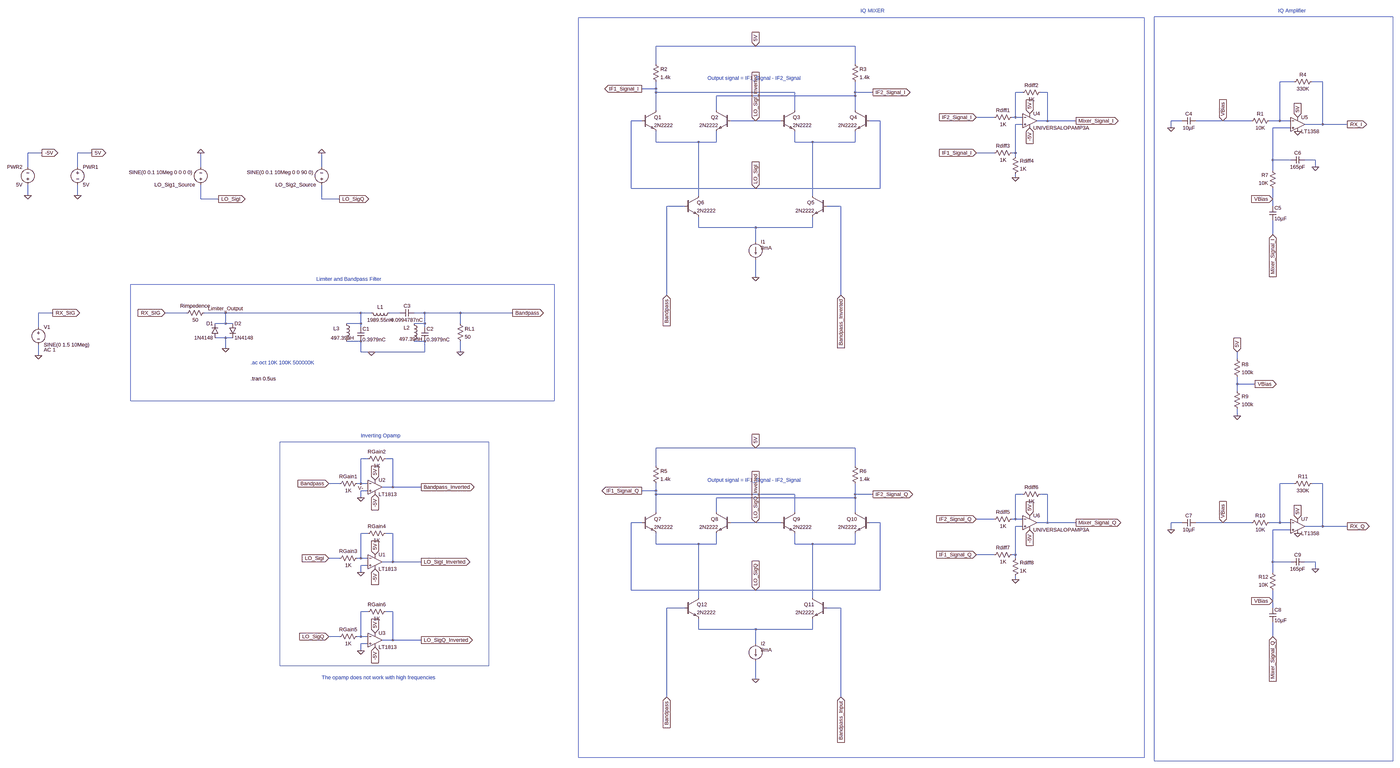
[diagram p0: schematic FULL_SCHEMATIC.asc, whole sheet]
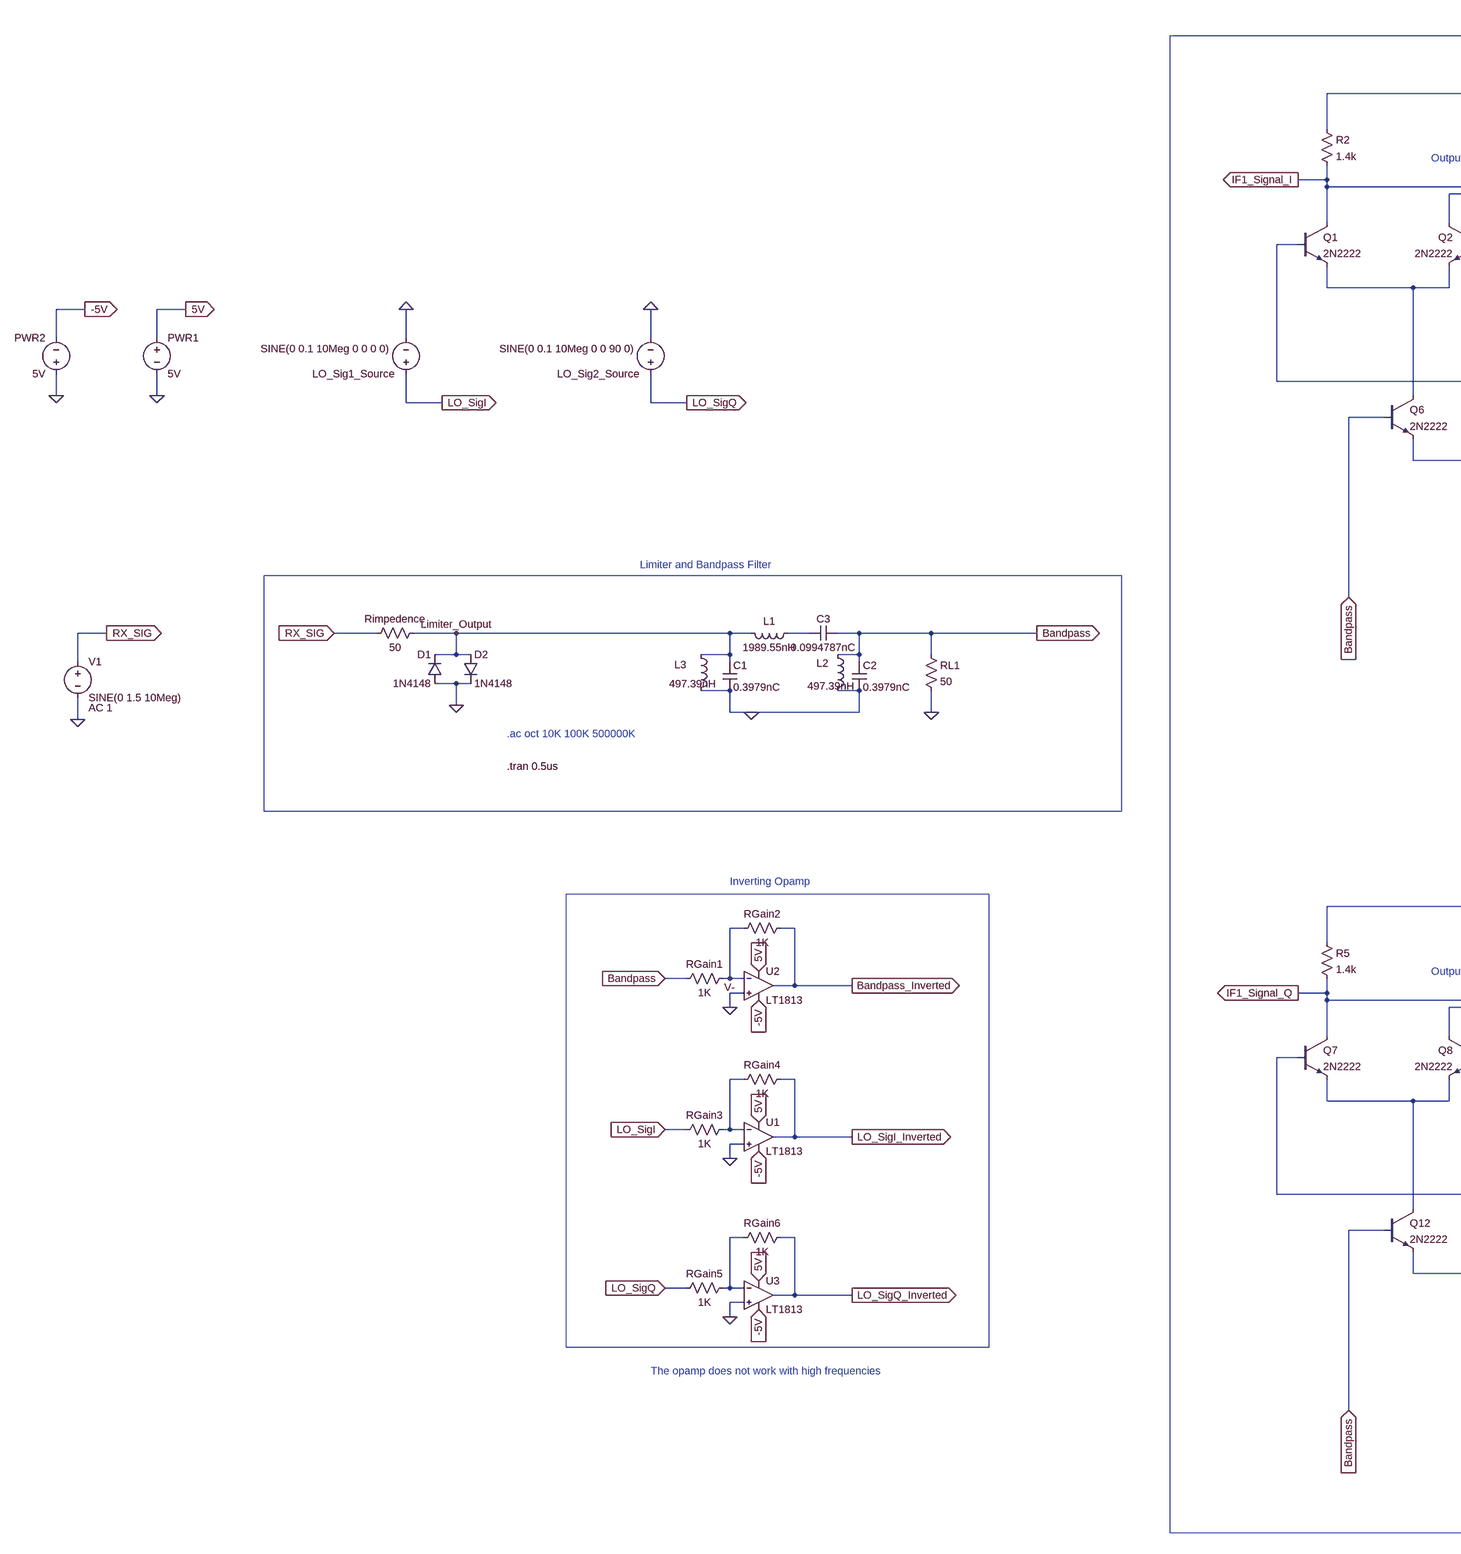
[diagram p1: schematic FULL_SCHEMATIC.asc, part, row 1 of 1, column 1 of 2]
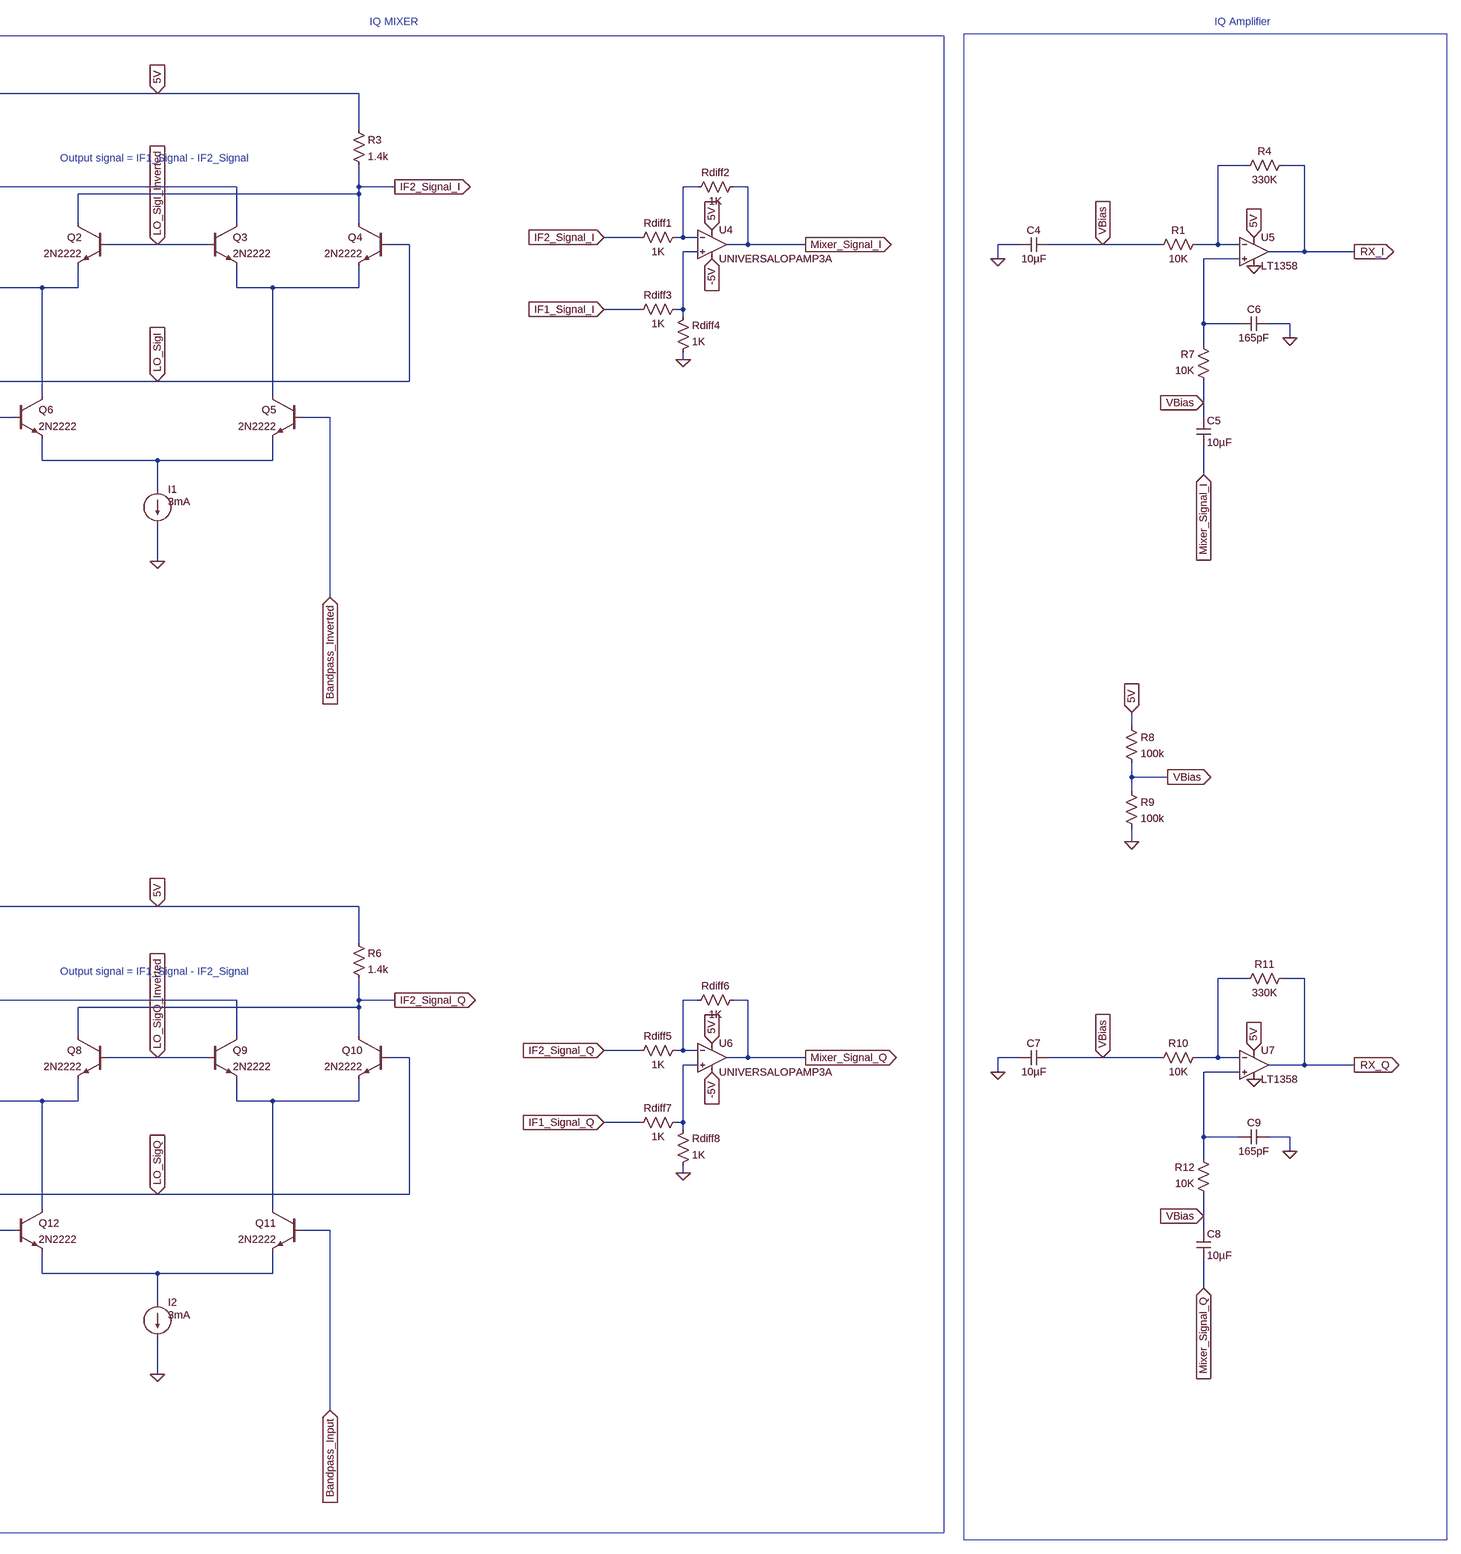
[diagram p2: schematic FULL_SCHEMATIC.asc, part, row 1 of 1, column 2 of 2]
FULL_SCHEMATIC.asc, the LTspice schematic file:
Version 4
SHEET 1 5976 2164
WIRE 2752 -1056 2304 -1056
WIRE 3200 -1056 2752 -1056
WIRE 2304 -976 2304 -1056
WIRE 3200 -976 3200 -1056
WIRE 5344 -896 5280 -896
WIRE 5472 -896 5424 -896
WIRE 2304 -864 2304 -896
WIRE 2304 -864 2240 -864
WIRE 2304 -848 2304 -864
WIRE 2928 -848 2304 -848
WIRE 3200 -848 3200 -896
WIRE 3280 -848 3200 -848
WIRE 4048 -848 4016 -848
WIRE 4160 -848 4128 -848
WIRE 3200 -832 3200 -848
WIRE 3200 -832 2576 -832
WIRE 2304 -768 2304 -848
WIRE 2576 -768 2576 -832
WIRE 2928 -768 2928 -848
WIRE 3200 -768 3200 -832
WIRE 3920 -736 3840 -736
WIRE 4016 -736 4016 -848
WIRE 4016 -736 4000 -736
WIRE 4048 -736 4016 -736
WIRE 2240 -720 2192 -720
WIRE 2752 -720 2640 -720
WIRE 2864 -720 2752 -720
WIRE 3312 -720 3264 -720
WIRE 4160 -720 4160 -848
WIRE 4160 -720 4112 -720
WIRE 4288 -720 4160 -720
WIRE 4832 -720 4784 -720
WIRE 5024 -720 4896 -720
WIRE 5152 -720 5024 -720
WIRE 5280 -720 5280 -896
WIRE 5280 -720 5232 -720
WIRE 5328 -720 5280 -720
WIRE 4048 -704 4016 -704
WIRE 5472 -704 5472 -896
WIRE 5472 -704 5392 -704
WIRE 5680 -704 5472 -704
WIRE 4784 -688 4784 -720
WIRE 5328 -688 5248 -688
WIRE 2304 -624 2304 -672
WIRE 2496 -624 2304 -624
WIRE 2576 -624 2576 -672
WIRE 2576 -624 2496 -624
WIRE 2928 -624 2928 -672
WIRE 3008 -624 2928 -624
WIRE 3200 -624 3200 -672
WIRE 3200 -624 3008 -624
WIRE -704 -576 -768 -576
WIRE -480 -576 -544 -576
WIRE 3920 -576 3840 -576
WIRE 4016 -576 4016 -704
WIRE 4016 -576 4000 -576
WIRE 4016 -560 4016 -576
WIRE 5248 -544 5248 -688
WIRE 5328 -544 5248 -544
WIRE 5440 -544 5392 -544
WIRE -768 -512 -768 -576
WIRE -544 -512 -544 -576
WIRE 48 -512 48 -576
WIRE 592 -512 592 -576
WIRE 5440 -512 5440 -544
WIRE 5248 -496 5248 -544
WIRE 4016 -464 4016 -480
WIRE 2192 -416 2192 -720
WIRE 2752 -416 2192 -416
WIRE 3312 -416 3312 -720
WIRE 3312 -416 2752 -416
WIRE -768 -384 -768 -432
WIRE -544 -384 -544 -432
WIRE 2496 -384 2496 -624
WIRE 3008 -384 3008 -624
WIRE 48 -368 48 -432
WIRE 128 -368 48 -368
WIRE 592 -368 592 -432
WIRE 672 -368 592 -368
WIRE 5248 -368 5248 -416
WIRE 2432 -336 2352 -336
WIRE 3136 -336 3072 -336
WIRE 5248 -336 5248 -368
WIRE 2496 -240 2496 -288
WIRE 2752 -240 2496 -240
WIRE 3008 -240 3008 -288
WIRE 3008 -240 2752 -240
WIRE 5248 -208 5248 -272
WIRE 2752 -176 2752 -240
WIRE 2752 -16 2752 -96
WIRE 2352 64 2352 -336
WIRE 3136 64 3136 -336
WIRE -656 144 -720 144
WIRE -16 144 -112 144
WIRE 160 144 64 144
WIRE 768 144 160 144
WIRE 816 144 768 144
WIRE 944 144 896 144
WIRE 1056 144 1008 144
WIRE 1216 144 1056 144
WIRE 1616 144 1216 144
WIRE 160 192 160 144
WIRE 160 192 112 192
WIRE 192 192 160 192
WIRE 768 192 768 144
WIRE 768 192 704 192
WIRE 1056 192 1056 144
WIRE 1056 192 1008 192
WIRE 1216 192 1216 144
WIRE -720 208 -720 144
WIRE 768 208 768 192
WIRE 1056 208 1056 192
WIRE 160 256 112 256
WIRE 192 256 160 256
WIRE 768 272 704 272
WIRE 1056 272 1008 272
WIRE 160 304 160 256
WIRE 768 320 768 272
WIRE 816 320 768 320
WIRE 1056 320 1056 272
WIRE 1056 320 816 320
WIRE 1216 320 1216 272
WIRE -720 336 -720 288
WIRE 5088 352 5088 320
WIRE 5088 464 5088 432
WIRE 5168 464 5088 464
WIRE 5088 496 5088 464
WIRE 5088 608 5088 576
WIRE 2752 752 2304 752
WIRE 3200 752 2752 752
WIRE 800 800 768 800
WIRE 912 800 880 800
WIRE 2304 832 2304 752
WIRE 3200 832 3200 752
WIRE 672 912 624 912
WIRE 768 912 768 800
WIRE 768 912 752 912
WIRE 800 912 768 912
WIRE 5344 912 5280 912
WIRE 5472 912 5424 912
WIRE 912 928 912 800
WIRE 912 928 864 928
WIRE 1040 928 912 928
WIRE 800 944 768 944
WIRE 2304 944 2304 912
WIRE 2304 944 2240 944
WIRE 2304 960 2304 944
WIRE 2928 960 2304 960
WIRE 3200 960 3200 912
WIRE 3280 960 3200 960
WIRE 4048 960 4016 960
WIRE 4160 960 4128 960
WIRE 768 976 768 944
WIRE 3200 976 3200 960
WIRE 3200 976 2576 976
WIRE 2304 1040 2304 960
WIRE 2576 1040 2576 976
WIRE 2928 1040 2928 960
WIRE 3200 1040 3200 976
WIRE 3920 1072 3840 1072
WIRE 4016 1072 4016 960
WIRE 4016 1072 4000 1072
WIRE 4048 1072 4016 1072
WIRE 2240 1088 2192 1088
WIRE 2752 1088 2640 1088
WIRE 2864 1088 2752 1088
WIRE 3312 1088 3264 1088
WIRE 4160 1088 4160 960
WIRE 4160 1088 4112 1088
WIRE 4288 1088 4160 1088
WIRE 4832 1088 4784 1088
WIRE 5024 1088 4896 1088
WIRE 5152 1088 5024 1088
WIRE 5280 1088 5280 912
WIRE 5280 1088 5232 1088
WIRE 5328 1088 5280 1088
WIRE 4048 1104 4016 1104
WIRE 5472 1104 5472 912
WIRE 5472 1104 5392 1104
WIRE 5680 1104 5472 1104
WIRE 4784 1120 4784 1088
WIRE 5328 1120 5248 1120
WIRE 800 1136 768 1136
WIRE 912 1136 880 1136
WIRE 2304 1184 2304 1136
WIRE 2496 1184 2304 1184
WIRE 2576 1184 2576 1136
WIRE 2576 1184 2496 1184
WIRE 2928 1184 2928 1136
WIRE 3008 1184 2928 1184
WIRE 3200 1184 3200 1136
WIRE 3200 1184 3008 1184
WIRE 3920 1232 3840 1232
WIRE 4016 1232 4016 1104
WIRE 4016 1232 4000 1232
WIRE 672 1248 624 1248
WIRE 768 1248 768 1136
WIRE 768 1248 752 1248
WIRE 800 1248 768 1248
WIRE 4016 1248 4016 1232
WIRE 912 1264 912 1136
WIRE 912 1264 864 1264
WIRE 1040 1264 912 1264
WIRE 5248 1264 5248 1120
WIRE 5328 1264 5248 1264
WIRE 5440 1264 5392 1264
WIRE 800 1280 768 1280
WIRE 5440 1296 5440 1264
WIRE 768 1312 768 1280
WIRE 5248 1312 5248 1264
WIRE 4016 1344 4016 1328
WIRE 2192 1392 2192 1088
WIRE 2752 1392 2192 1392
WIRE 3312 1392 3312 1088
WIRE 3312 1392 2752 1392
WIRE 2496 1424 2496 1184
WIRE 3008 1424 3008 1184
WIRE 5248 1440 5248 1392
WIRE 2432 1472 2352 1472
WIRE 3136 1472 3072 1472
WIRE 5248 1472 5248 1440
WIRE 800 1488 768 1488
WIRE 912 1488 880 1488
WIRE 2496 1568 2496 1520
WIRE 2752 1568 2496 1568
WIRE 3008 1568 3008 1520
WIRE 3008 1568 2752 1568
WIRE 672 1600 624 1600
WIRE 768 1600 768 1488
WIRE 768 1600 752 1600
WIRE 800 1600 768 1600
WIRE 5248 1600 5248 1536
WIRE 912 1616 912 1488
WIRE 912 1616 864 1616
WIRE 1040 1616 912 1616
WIRE 800 1632 768 1632
WIRE 2752 1632 2752 1568
WIRE 768 1664 768 1632
WIRE 2752 1792 2752 1712
WIRE 2352 1872 2352 1472
WIRE 3136 1872 3136 1472
FLAG 160 144 Limiter_Output
FLAG -112 144 RX_SIG
IOPIN -112 144 In
FLAG 816 320 0
FLAG -720 336 0
FLAG -656 144 RX_SIG
IOPIN -656 144 Out
FLAG 160 304 0
FLAG 2752 -16 0
FLAG 2240 -864 IF1_Signal_I
IOPIN 2240 -864 Out
FLAG 3280 -848 IF2_Signal_I
IOPIN 3280 -848 Out
FLAG 2752 -1056 5V
IOPIN 2752 -1056 In
FLAG -544 -384 0
FLAG -480 -576 5V
IOPIN -480 -576 Out
FLAG -768 -384 0
FLAG -704 -576 -5V
IOPIN -704 -576 Out
FLAG 1216 320 0
FLAG 832 1232 5V
IOPIN 832 1232 In
FLAG 832 1296 -5V
IOPIN 832 1296 In
FLAG 768 1312 0
FLAG 832 1584 5V
IOPIN 832 1584 In
FLAG 832 1648 -5V
IOPIN 832 1648 In
FLAG 768 1664 0
FLAG 832 896 5V
IOPIN 832 896 In
FLAG 832 960 -5V
IOPIN 832 960 In
FLAG 768 976 0
FLAG 1616 144 Bandpass
IOPIN 1616 144 Out
FLAG 1040 928 Bandpass_Inverted
IOPIN 1040 928 Out
FLAG 768 912 V-
FLAG 624 912 Bandpass
IOPIN 624 912 In
FLAG 48 -576 0
FLAG 128 -368 LO_SigI
IOPIN 128 -368 Out
FLAG 592 -576 0
FLAG 672 -368 LO_SigQ
IOPIN 672 -368 Out
FLAG 624 1248 LO_SigI
IOPIN 624 1248 In
FLAG 624 1600 LO_SigQ
IOPIN 624 1600 In
FLAG 1040 1264 LO_SigI_Inverted
IOPIN 1040 1264 Out
FLAG 1040 1616 LO_SigQ_Inverted
IOPIN 1040 1616 Out
FLAG 2352 64 Bandpass
IOPIN 2352 64 In
FLAG 3136 64 Bandpass_Inverted
IOPIN 3136 64 In
FLAG 2752 -720 LO_SigI_Inverted
IOPIN 2752 -720 In
FLAG 2752 -416 LO_SigI
IOPIN 2752 -416 In
FLAG 4080 -752 5V
IOPIN 4080 -752 In
FLAG 4080 -688 -5V
IOPIN 4080 -688 In
FLAG 4016 -464 0
FLAG 4288 -720 Mixer_Signal_I
IOPIN 4288 -720 Out
FLAG 3840 -576 IF1_Signal_I
IOPIN 3840 -576 In
FLAG 3840 -736 IF2_Signal_I
IOPIN 3840 -736 In
FLAG 5360 -736 5V
IOPIN 5360 -736 In
FLAG 5360 -672 0
FLAG 5680 -704 RX_I
IOPIN 5680 -704 Out
FLAG 4784 -688 0
FLAG 5088 608 0
FLAG 5088 320 5V
IOPIN 5088 320 In
FLAG 5440 -512 0
FLAG 5168 464 VBias
IOPIN 5168 464 Out
FLAG 5024 -720 VBias
IOPIN 5024 -720 In
FLAG 5248 -368 VBias
IOPIN 5248 -368 In
FLAG 5248 -208 Mixer_Signal_I
IOPIN 5248 -208 In
FLAG 2752 1792 0
FLAG 2240 944 IF1_Signal_Q
IOPIN 2240 944 Out
FLAG 3280 960 IF2_Signal_Q
IOPIN 3280 960 Out
FLAG 2752 752 5V
IOPIN 2752 752 In
FLAG 2352 1872 Bandpass
IOPIN 2352 1872 In
FLAG 3136 1872 Bandpass_Input
IOPIN 3136 1872 In
FLAG 2752 1088 LO_SigQ_Inverted
IOPIN 2752 1088 In
FLAG 2752 1392 LO_SigQ
IOPIN 2752 1392 In
FLAG 4080 1056 5V
IOPIN 4080 1056 In
FLAG 4080 1120 -5V
IOPIN 4080 1120 In
FLAG 4016 1344 0
FLAG 4288 1088 Mixer_Signal_Q
IOPIN 4288 1088 Out
FLAG 3840 1232 IF1_Signal_Q
IOPIN 3840 1232 In
FLAG 3840 1072 IF2_Signal_Q
IOPIN 3840 1072 In
FLAG 5360 1072 5V
IOPIN 5360 1072 In
FLAG 5360 1136 0
FLAG 5680 1104 RX_Q
IOPIN 5680 1104 Out
FLAG 4784 1120 0
FLAG 5440 1296 0
FLAG 5024 1088 VBias
IOPIN 5024 1088 In
FLAG 5248 1440 VBias
IOPIN 5248 1440 In
FLAG 5248 1600 Mixer_Signal_Q
IOPIN 5248 1600 In
SYMBOL Res 80 128 R90
WINDOW 0 0 56 VBottom 2
WINDOW 3 32 56 VTop 2
SYMATTR InstName Rimpedence
SYMATTR Value 50
SYMBOL diode 128 256 R180
WINDOW 0 24 64 Left 2
WINDOW 3 24 0 Left 2
SYMATTR InstName D1
SYMATTR Value 1N4148
SYMBOL diode 176 192 R0
SYMATTR InstName D2
SYMATTR Value 1N4148
SYMBOL Cap 752 208 R0
SYMATTR InstName C1
SYMATTR Value 0.3979nC
SYMBOL Cap 1040 208 R0
SYMATTR InstName C2
SYMATTR Value 0.3979nC
SYMBOL Ind 912 128 R90
WINDOW 0 5 56 VBottom 2
WINDOW 3 32 56 VTop 2
SYMATTR InstName L1
SYMATTR Value 1989.55nH
SYMBOL Res 1200 176 R0
SYMATTR InstName RL1
SYMATTR Value 50
SYMBOL ind 992 176 R0
WINDOW 0 -31 35 Left 2
WINDOW 3 -51 86 Left 2
SYMATTR InstName L2
SYMATTR Value 497.39nH
SYMBOL Ind 688 176 R0
WINDOW 0 -43 38 Left 2
WINDOW 3 -55 81 Left 2
SYMATTR InstName L3
SYMATTR Value 497.39nH
SYMBOL Cap 1008 128 R90
WINDOW 0 0 32 VBottom 2
WINDOW 3 32 32 VTop 2
SYMATTR InstName C3
SYMATTR Value 0.0994787nC
SYMBOL Voltage -720 192 R0
WINDOW 123 24 118 Left 2
SYMATTR Value2 AC 1
SYMATTR InstName V1
SYMATTR Value SINE(0 1.5 10Meg)
SYMBOL npn 2240 -768 R0
SYMATTR InstName Q1
SYMATTR Value 2N2222
SYMBOL npn 2640 -768 M0
SYMATTR InstName Q2
SYMATTR Value 2N2222
SYMBOL npn 2864 -768 R0
SYMATTR InstName Q3
SYMATTR Value 2N2222
SYMBOL npn 3264 -768 M0
SYMATTR InstName Q4
SYMATTR Value 2N2222
SYMBOL npn 3072 -384 M0
SYMATTR InstName Q5
SYMATTR Value 2N2222
SYMBOL npn 2432 -384 R0
SYMATTR InstName Q6
SYMATTR Value 2N2222
SYMBOL res 2288 -992 R0
SYMATTR InstName R2
SYMATTR Value 1.4k
SYMBOL res 3184 -992 R0
SYMATTR InstName R3
SYMATTR Value 1.4k
SYMBOL voltage 48 -416 R180
WINDOW 3 35 72 Left 2
WINDOW 123 0 0 Left 0
WINDOW 39 0 0 Left 0
SYMATTR Value SINE(0 0.1 10Meg 0 0 0 0)
SYMATTR InstName LO_Sig1_Source
SYMBOL current 2752 -176 R0
WINDOW 123 0 0 Left 0
WINDOW 39 0 0 Left 0
WINDOW 3 24 28 Left 2
SYMATTR Value 3mA
SYMATTR InstName I1
SYMBOL Voltage -544 -528 R0
SYMATTR InstName PWR1
SYMATTR Value 5V
SYMBOL Voltage -768 -416 R180
WINDOW 0 24 96 Left 2
WINDOW 3 24 16 Left 2
SYMATTR InstName PWR2
SYMATTR Value 5V
SYMBOL Res 768 1232 R90
WINDOW 0 0 56 VBottom 2
WINDOW 3 32 56 VTop 2
SYMATTR InstName RGain3
SYMATTR Value 1K
SYMBOL Res 896 1120 R90
WINDOW 0 0 56 VBottom 2
WINDOW 3 32 56 VTop 2
SYMATTR InstName RGain4
SYMATTR Value 1K
SYMBOL Res 768 1584 R90
WINDOW 0 0 56 VBottom 2
WINDOW 3 32 56 VTop 2
SYMATTR InstName RGain5
SYMATTR Value 1K
SYMBOL Res 896 1472 R90
WINDOW 0 0 56 VBottom 2
WINDOW 3 32 56 VTop 2
SYMATTR InstName RGain6
SYMATTR Value 1K
SYMBOL Res 768 896 R90
WINDOW 0 0 56 VBottom 2
WINDOW 3 32 56 VTop 2
SYMATTR InstName RGain1
SYMATTR Value 1K
SYMBOL Res 896 784 R90
WINDOW 0 0 56 VBottom 2
WINDOW 3 32 56 VTop 2
SYMATTR InstName RGain2
SYMATTR Value 1K
SYMBOL voltage 592 -416 R180
WINDOW 3 35 72 Left 2
WINDOW 123 0 0 Left 0
WINDOW 39 0 0 Left 0
SYMATTR Value SINE(0 0.1 10Meg 0 0 90 0)
SYMATTR InstName LO_Sig2_Source
SYMBOL Res 4016 -752 R90
WINDOW 0 0 56 VBottom 2
WINDOW 3 32 56 VTop 2
SYMATTR InstName Rdiff1
SYMATTR Value 1K
SYMBOL Res 4144 -864 R90
WINDOW 0 0 56 VBottom 2
WINDOW 3 32 56 VTop 2
SYMATTR InstName Rdiff2
SYMATTR Value 1K
SYMBOL OpAmps/UniversalOpAmp3a 4080 -720 R0
SYMATTR InstName U4
SYMBOL Res 4016 -592 R90
WINDOW 0 0 56 VBottom 2
WINDOW 3 32 56 VTop 2
SYMATTR InstName Rdiff3
SYMATTR Value 1K
SYMBOL Res 4000 -464 M180
WINDOW 0 36 76 Left 2
WINDOW 3 36 40 Left 2
SYMATTR InstName Rdiff4
SYMATTR Value 1K
SYMBOL Res 5248 -736 R90
WINDOW 0 0 56 VBottom 2
WINDOW 3 32 56 VTop 2
SYMATTR InstName R1
SYMATTR Value 10K
SYMBOL OpAmps/LT1358 5360 -768 R0
SYMATTR InstName U5
SYMBOL Res 5440 -912 R90
WINDOW 0 0 56 VBottom 2
WINDOW 3 32 56 VTop 2
SYMATTR InstName R4
SYMATTR Value 330K
SYMBOL Cap 4896 -736 R90
WINDOW 0 0 32 VBottom 2
WINDOW 3 32 32 VTop 2
SYMATTR InstName C4
SYMATTR Value 10µF
SYMBOL Res 5264 -400 R180
WINDOW 0 36 76 Left 2
WINDOW 3 36 40 Left 2
SYMATTR InstName R7
SYMATTR Value 10K
SYMBOL Cap 5232 -336 R0
SYMATTR InstName C5
SYMATTR Value 10µF
SYMBOL Res 5072 336 R0
SYMATTR InstName R8
SYMATTR Value 100k
SYMBOL Res 5072 480 R0
SYMATTR InstName R9
SYMATTR Value 100k
SYMBOL Cap 5392 -560 R90
WINDOW 0 0 32 VBottom 2
WINDOW 3 32 32 VTop 2
SYMATTR InstName C6
SYMATTR Value 165pF
SYMBOL npn 2240 1040 R0
SYMATTR InstName Q7
SYMATTR Value 2N2222
SYMBOL npn 2640 1040 M0
SYMATTR InstName Q8
SYMATTR Value 2N2222
SYMBOL npn 2864 1040 R0
SYMATTR InstName Q9
SYMATTR Value 2N2222
SYMBOL npn 3264 1040 M0
SYMATTR InstName Q10
SYMATTR Value 2N2222
SYMBOL npn 3072 1424 M0
SYMATTR InstName Q11
SYMATTR Value 2N2222
SYMBOL npn 2432 1424 R0
SYMATTR InstName Q12
SYMATTR Value 2N2222
SYMBOL res 2288 816 R0
SYMATTR InstName R5
SYMATTR Value 1.4k
SYMBOL res 3184 816 R0
SYMATTR InstName R6
SYMATTR Value 1.4k
SYMBOL current 2752 1632 R0
WINDOW 123 0 0 Left 0
WINDOW 39 0 0 Left 0
WINDOW 3 24 28 Left 2
SYMATTR Value 3mA
SYMATTR InstName I2
SYMBOL Res 4016 1056 R90
WINDOW 0 0 56 VBottom 2
WINDOW 3 32 56 VTop 2
SYMATTR InstName Rdiff5
SYMATTR Value 1K
SYMBOL Res 4144 944 R90
WINDOW 0 0 56 VBottom 2
WINDOW 3 32 56 VTop 2
SYMATTR InstName Rdiff6
SYMATTR Value 1K
SYMBOL OpAmps/UniversalOpAmp3a 4080 1088 R0
SYMATTR InstName U6
SYMBOL Res 4016 1216 R90
WINDOW 0 0 56 VBottom 2
WINDOW 3 32 56 VTop 2
SYMATTR InstName Rdiff7
SYMATTR Value 1K
SYMBOL Res 4000 1344 M180
WINDOW 0 36 76 Left 2
WINDOW 3 36 40 Left 2
SYMATTR InstName Rdiff8
SYMATTR Value 1K
SYMBOL Res 5248 1072 R90
WINDOW 0 0 56 VBottom 2
WINDOW 3 32 56 VTop 2
SYMATTR InstName R10
SYMATTR Value 10K
SYMBOL OpAmps/LT1358 5360 1040 R0
SYMATTR InstName U7
SYMBOL Res 5440 896 R90
WINDOW 0 0 56 VBottom 2
WINDOW 3 32 56 VTop 2
SYMATTR InstName R11
SYMATTR Value 330K
SYMBOL Cap 4896 1072 R90
WINDOW 0 0 32 VBottom 2
WINDOW 3 32 32 VTop 2
SYMATTR InstName C7
SYMATTR Value 10µF
SYMBOL Res 5264 1408 R180
WINDOW 0 36 76 Left 2
WINDOW 3 36 40 Left 2
SYMATTR InstName R12
SYMATTR Value 10K
SYMBOL Cap 5232 1472 R0
SYMATTR InstName C8
SYMATTR Value 10µF
SYMBOL Cap 5392 1248 R90
WINDOW 0 0 32 VBottom 2
WINDOW 3 32 32 VTop 2
SYMATTR InstName C9
SYMATTR Value 165pF
SYMBOL OpAmps/LT1813 832 864 R0
SYMATTR InstName U2
SYMBOL OpAmps/LT1813 832 1200 R0
SYMATTR InstName U1
SYMBOL OpAmps/LT1813 832 1552 R0
SYMATTR InstName U3
TEXT 272 368 Left 2 ;.ac oct 10K 100K 500000K
TEXT 272 440 Left 2 !.tran 0.5us
TEXT 2536 -912 Left 2 ;Output signal = IF1_Signal - IF2_Signal
TEXT 592 1784 Left 2 ;The opamp does not work with high frequencies
TEXT 2536 896 Left 2 ;Output signal = IF1_Signal - IF2_Signal
TEXT 3224 -1216 Left 2 ;IQ MIXER
TEXT 5272 -1216 Left 2 ;IQ Amplifier
TEXT 768 696 Left 2 ;Inverting Opamp
TEXT 568 -8 Left 2 ;Limiter and Bandpass Filter
RECTANGLE Normal 404 1732 1344 724
RECTANGLE Normal 1920 2144 4664 -1184
RECTANGLE Normal 4708 -1188 5972 2160
RECTANGLE Normal -268 16 1804 540

The netlist it stands for:
* FULL_SCHEMATIC.asc
Rimpedence Limiter_Output RX_SIG 50
D1 0 Limiter_Output 1N4148
D2 Limiter_Output 0 1N4148
C1 Limiter_Output 0 0.3979nC
C2 Bandpass 0 0.3979nC
L1 N008 Limiter_Output 1989.55nH
RL1 Bandpass 0 50
L2 Bandpass 0 497.39nH
L3 Limiter_Output 0 497.39nH
C3 Bandpass N008 0.0994787nC
V1 RX_SIG 0 SINE(0 1.5 10Meg) AC 1
Q1 IF1_Signal_I LO_SigI N005 0 2N2222
Q2 IF2_Signal_I LO_SigI_Inverted N005 0 2N2222
Q3 IF1_Signal_I LO_SigI_Inverted N006 0 2N2222
Q4 IF2_Signal_I LO_SigI N006 0 2N2222
Q5 N006 Bandpass_Inverted N007 0 2N2222
Q6 N005 Bandpass N007 0 2N2222
R2 5V IF1_Signal_I 1.4k
R3 5V IF2_Signal_I 1.4k
V§LO_Sig1_Source LO_SigI 0 SINE(0 0.1 10Meg 0 0 0 0)
I1 N007 0 3mA
V§PWR1 5V 0 5V
V§PWR2 0 -5V 5V
RGain3 N013 LO_SigI 1K
RGain4 LO_SigI_Inverted N013 1K
RGain5 N016 LO_SigQ 1K
RGain6 LO_SigQ_Inverted N016 1K
RGain1 V- Bandpass 1K
RGain2 Bandpass_Inverted V- 1K
V§LO_Sig2_Source LO_SigQ 0 SINE(0 0.1 10Meg 0 0 90 0)
Rdiff1 N002 IF2_Signal_I 1K
Rdiff2 Mixer_Signal_I N002 1K
XU4 N003 N002 5V -5V Mixer_Signal_I level3a Avol=1Meg GBW=10Meg Slew=10Meg Ilimit=25m Rail=0 Vos=0 Phimargin=45 En=0 Enk=0 In=0 Ink=0 Rin=500Meg  ; UNIVERSALOPAMP3A, pins In+ In- V+ V- OUT
Rdiff3 N003 IF1_Signal_I 1K
Rdiff4 0 N003 1K
R1 N001 VBias 10K
XU5 N004 N001 5V 0 RX_I LT1357  ; LT1358, pins In+ In- V+ V- OUT
R4 RX_I N001 330K
C4 VBias 0 10µF
R7 VBias N004 10K
C5 VBias Mixer_Signal_I 10µF
R8 5V VBias 100k
R9 VBias 0 100k
C6 0 N004 165pF
Q7 IF1_Signal_Q LO_SigQ N014 0 2N2222
Q8 IF2_Signal_Q LO_SigQ_Inverted N014 0 2N2222
Q9 IF1_Signal_Q LO_SigQ_Inverted N015 0 2N2222
Q10 IF2_Signal_Q LO_SigQ N015 0 2N2222
Q11 N015 Bandpass_Input N017 0 2N2222
Q12 N014 Bandpass N017 0 2N2222
R5 5V IF1_Signal_Q 1.4k
R6 5V IF2_Signal_Q 1.4k
I2 N017 0 3mA
Rdiff5 N010 IF2_Signal_Q 1K
Rdiff6 Mixer_Signal_Q N010 1K
XU6 N011 N010 5V -5V Mixer_Signal_Q level3a Avol=1Meg GBW=10Meg Slew=10Meg Ilimit=25m Rail=0 Vos=0 Phimargin=45 En=0 Enk=0 In=0 Ink=0 Rin=500Meg  ; UNIVERSALOPAMP3A, pins In+ In- V+ V- OUT
Rdiff7 N011 IF1_Signal_Q 1K
Rdiff8 0 N011 1K
R10 N009 VBias 10K
XU7 N012 N009 5V 0 RX_Q LT1357  ; LT1358, pins In+ In- V+ V- OUT
R11 RX_Q N009 330K
C7 VBias 0 10µF
R12 VBias N012 10K
C8 VBias Mixer_Signal_Q 10µF
C9 0 N012 165pF
XU2 0 V- 5V -5V Bandpass_Inverted LT1813  ; pins In+ In- V+ V- OUT
XU1 0 N013 5V -5V LO_SigI_Inverted LT1813  ; pins In+ In- V+ V- OUT
XU3 0 N016 5V -5V LO_SigQ_Inverted LT1813  ; pins In+ In- V+ V- OUT
.model D D
.lib standard.dio
.model NPN NPN
.model PNP PNP
.lib standard.bjt
* .ac oct 10K 100K 500000K
.tran 0.5us
* Output signal = IF1_Signal - IF2_Signal
* The opamp does not work with high frequencies
* Output signal = IF1_Signal - IF2_Signal
* IQ MIXER
* IQ Amplifier
* Inverting Opamp
* Limiter and Bandpass Filter
.lib LTC.lib
.backanno
.end